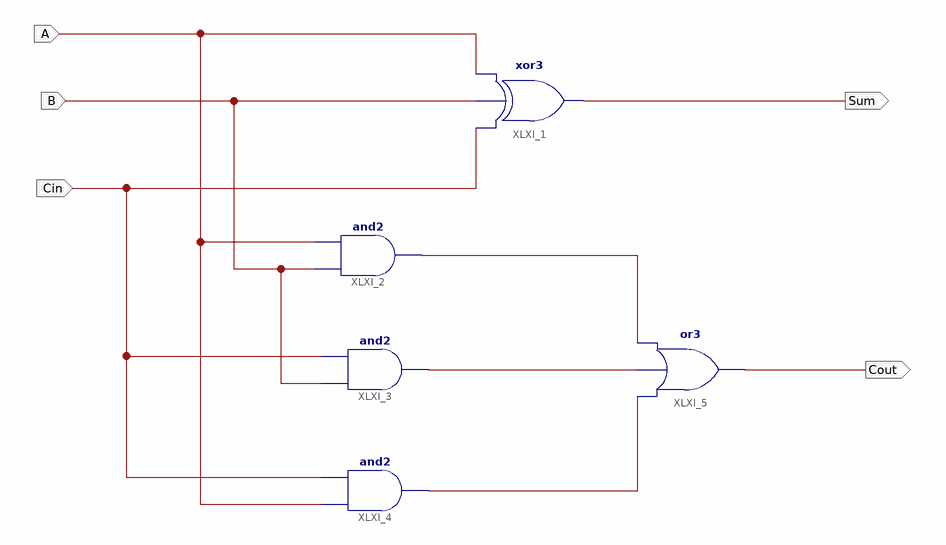
[diagram p0: schematic sheet 1]
// Xilinx ISE schematic FullAdder.sch (aspartan6) as structural Verilog: 5 symbols, 5 ports
module FullAdder (
  input  A,
  input  B,
  input  Cin,
  output Sum,
  output Cout
);

  wire XLXN_22, XLXN_23, XLXN_24;

  xor XLXI_1 (Sum, Cin, B, A);
  and XLXI_2 (XLXN_22, B, A);
  and XLXI_3 (XLXN_23, B, Cin);
  and XLXI_4 (XLXN_24, A, Cin);
  or XLXI_5 (Cout, XLXN_24, XLXN_23, XLXN_22);
endmodule
